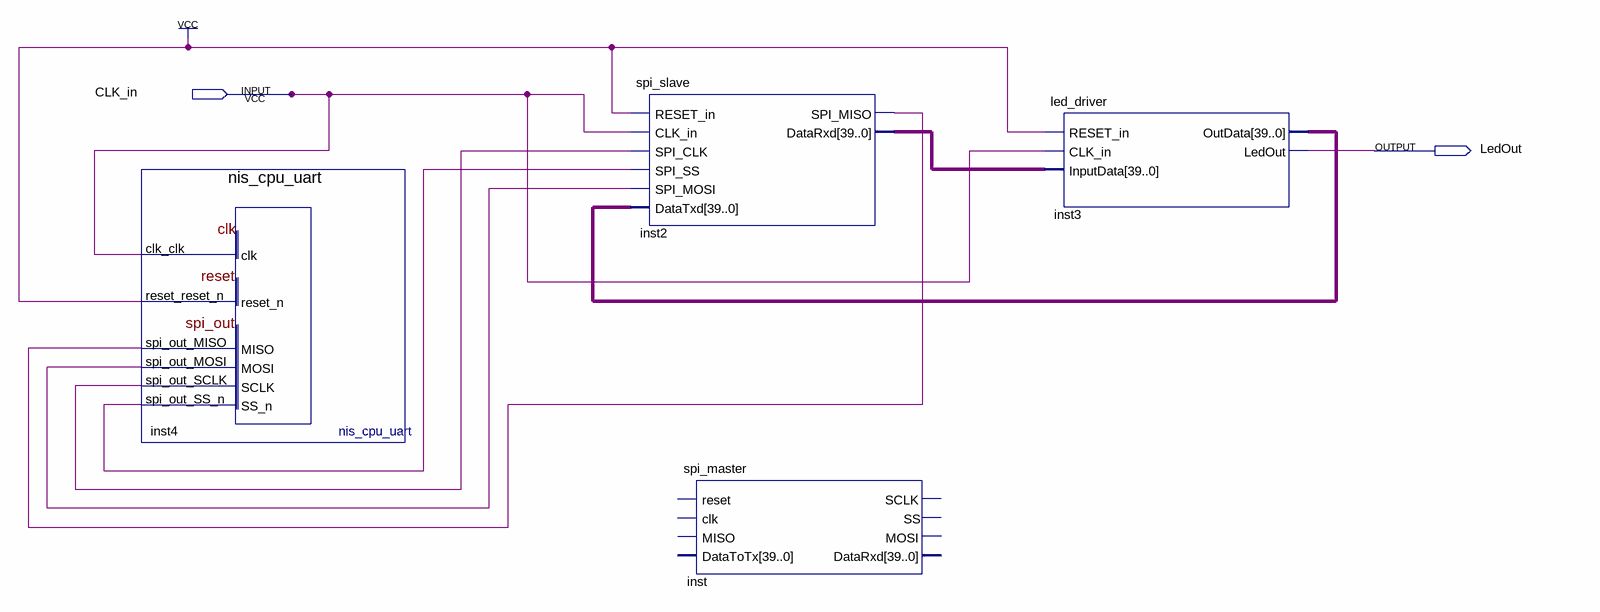
[diagram p0: schematic sheet]
// Quartus schematic uartSPI.bdf as structural Verilog: 4 symbols, 2 pins
module uartSPI (
  input  CLK_in,
  output LedOut
);

  wire inst2_spi_miso, inst4_spi_out_mosi, inst4_spi_out_sclk, inst4_spi_out_ss_n;
  wire [39:0] inst2_datarxd, inst3_outdata;

  nis_cpu_uart inst4 (
    .clk_clk(CLK_in), .reset_reset_n(1'b1), .spi_out_MISO(inst2_spi_miso), .spi_out_MOSI(inst4_spi_out_mosi),
    .spi_out_SCLK(inst4_spi_out_sclk), .spi_out_SS_n(inst4_spi_out_ss_n));
  spi_slave inst2 (
    .RESET_in(1'b1), .CLK_in(CLK_in), .SPI_CLK(inst4_spi_out_sclk), .SPI_SS(inst4_spi_out_ss_n),
    .SPI_MOSI(inst4_spi_out_mosi), .DataTxd(inst3_outdata), .SPI_MISO(inst2_spi_miso), .DataRxd(inst2_datarxd));
  spi_master inst ();  // open: reset, clk, MISO, DataToTx, SCLK, SS, MOSI, DataRxd
  led_driver inst3 (
    .RESET_in(1'b1), .CLK_in(CLK_in), .InputData(inst2_datarxd), .OutData(inst3_outdata), .LedOut(LedOut));
endmodule
